# EAGLE board TeensyAmp_R5.0 (EAGLE 9.6.2)
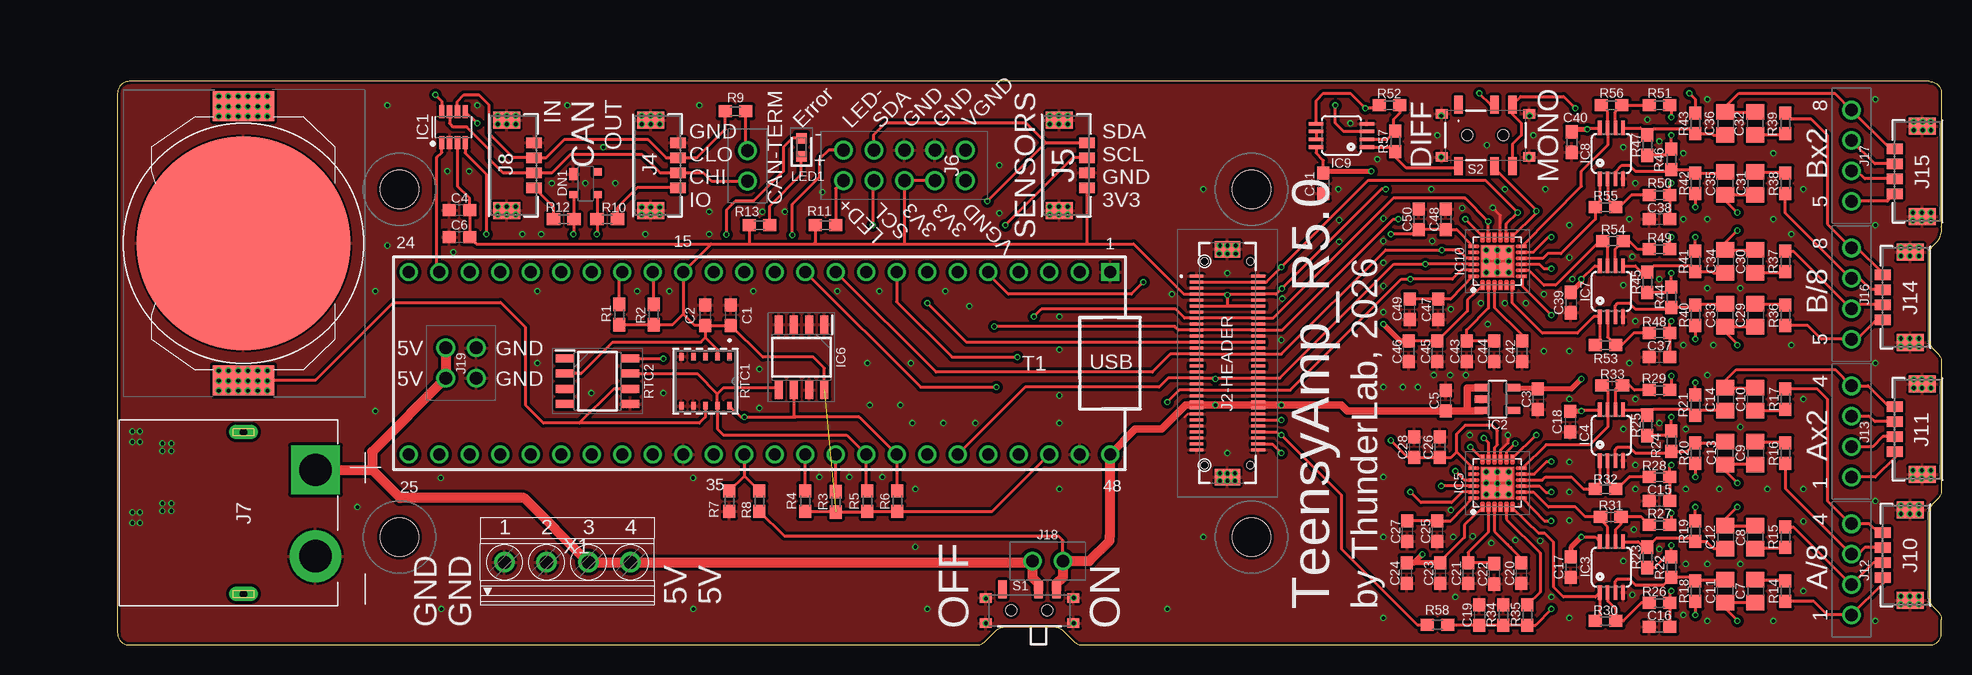
[diagram p3: board, top side]
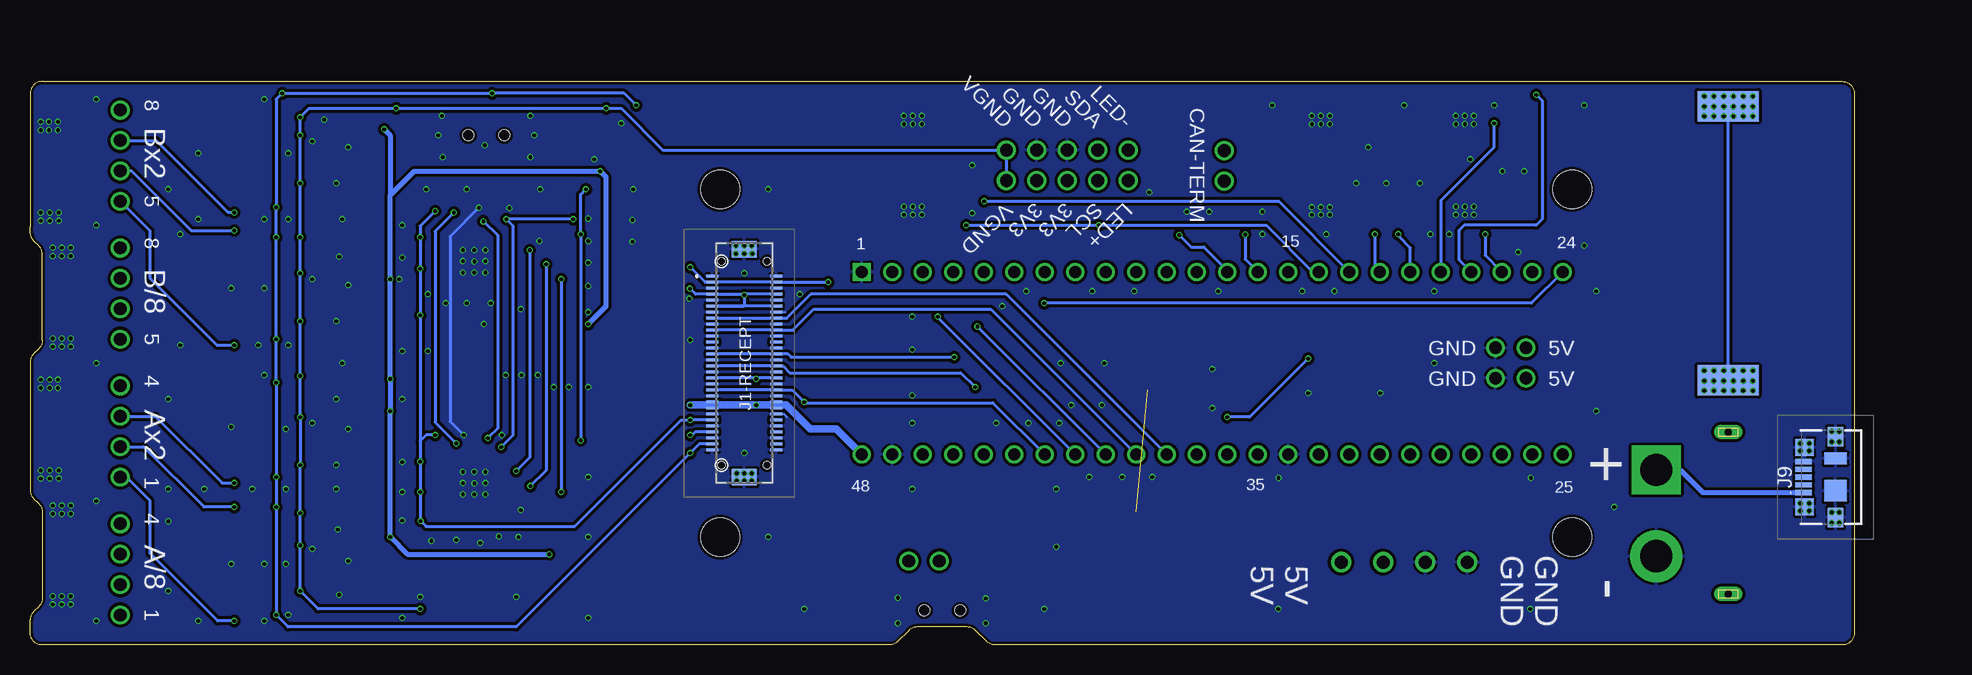
[diagram p4: board, bottom side, seen from below]

Size 152.02 x 47 mm. Coordinates in mm from the lower left corner, seen from the top.
Outline: 69.5,0 1,0 arc-90 0,1 0,46 arc-90 1,47 151,47 arc-90 152,46 152,34.91 arc-45 151.71,33.71 151.29,33.29 arc45 151,32.59 151,25.41 arc45 151.29,24.71 151.71,24.29 arc-45 152,23.59 152,12.91 arc-45 151.71,12.21 151.29,11.79 arc45 151,11.09 151,3.91 arc45 151.29,3.21 151.71,2.79 arc-45 152,2.09 152,1 arc-90 151,0 82.5,0 80.41,0 arc-45 79.71,0.29 78.79,1.21 arc45 78.09,1.5 73.91,1.5 arc45 73.21,1.21 72.29,0.29 arc-45 71.59,0 69.5,0
Outline: 69.5,0 69.59,0
Copper layers (1*16): Top 0.018mm / dielectric 1.55mm / Bottom 0.018mm
Design rules "Multi-CB_2L_100цm-Tracks_OL35цm *": minimum track width 0.1mm, minimum drill 0.2mm, track to track 0.1mm, track to pad 0.1mm, pad to pad 0.1mm, via to via 0.1mm, smd to smd 0mil, copper to edge 0.2mm, drill to drill 0.2mm, minimum pad ring 0.125mm, minimum via ring 0.1mm, stop-mask expansion 2mil, vias tented up to drill 0.45mm, thermal gap 0.2mm
Net classes: 0 default: clearance 0.205 mm
Holes 3.2 mm at 23.5,9 94.5,9 23.5,38 94.5,38

## Footprints (pad centres in the part's own frame; a part is rotated, then mirrored left to right if it is on the bottom)
BATHLD001 = smd 2.5 x 5.1: 1 -11.45,0; 2 11.43,0 | smd 2.54 x 5.08 bottom: 1B -11.43,0; 2B 11.43,0 | smd 17.8 x 17.8: 3 0,0
C0603 = smd 1.1 x 1: 1 -0.85,0; 2 0.85,0
C0805 = smd 1.3 x 1.5: 1 -0.95,0; 2 0.95,0
JMP1X2 = drill 1.05 pad 1.575: 1 0,0; 2 2.54,0
SOT143-R = smd 1 x 0.7: 1 -0.75,-1 | smd 0.6 x 0.7: 2 0.95,-1; 3 0.95,1; 4 -0.95,1
SOT65P280X145-8N = smd 1.1 x 0.44: 1 -1.3,0.975; 2 -1.3,0.325; 3 -1.3,-0.325; 4 -1.3,-0.975; 5 1.3,-0.975; 6 1.3,-0.325; 7 1.3,0.325; 8 1.3,0.975
SOT23-5 = smd 0.6 x 1.2: 1 -0.95,-1.306; 2 0,-1.306; 3 0.95,-1.306; 4 0.95,1.306; 5 -0.95,1.306
MSOP08 = smd 0.3 x 1.2: 1 -0.976,-2.113; 2 -0.326,-2.113; 3 0.324,-2.113; 4 0.974,-2.113; 5 0.974,2.112; 6 0.324,2.112; 7 -0.326,2.112; 8 -0.976,2.112
QFN50P400X400X80-25N = smd 0.5 x 0.2: 1 -2.05,1.25; 2 -2.05,0.75; 3 -2.05,0.25; 4 -2.05,-0.25; 5 -2.05,-0.75; 6 -2.05,-1.25; 13 2.05,-1.25; 14 2.05,-0.75; 15 2.05,-0.25; 16 2.05,0.25; 17 2.05,0.75; 18 2.05,1.25 | smd 0.2 x 0.5: 7 -1.25,-2.05; 8 -0.75,-2.05; 9 -0.25,-2.05; 10 0.25,-2.05; 11 0.75,-2.05; 12 1.25,-2.05; 19 1.25,2.05; 20 0.75,2.05; 21 0.25,2.05; 22 -0.25,2.05; 23 -0.75,2.05; 24 -1.25,2.05 | smd 1.1 x 1.1: 25 -0.71,0.7; 26 0.7,0.7; 27 -0.7,-0.7; 28 0.7,-0.7
SOIC127P600X175-8N = smd 1.525 x 0.65: 1 -2.712,1.905; 2 -2.712,0.635; 3 -2.712,-0.635; 4 -2.712,-1.905; 5 2.712,-1.905; 6 2.712,-0.635; 7 2.712,0.635; 8 2.712,1.905
DF173060DS05V57 = smd 0.25 x 1: 1 -7.25,-2.65; 2 -7.25,2.65; 3 -6.75,-2.65; 4 -6.75,2.65; 5 -6.25,-2.65; 6 -6.25,2.65; 7 -5.75,-2.65; 8 -5.75,2.65; 9 -5.25,-2.65; 10 -5.25,2.65; 11 -4.75,-2.65; 12 -4.75,2.65; 13 -4.25,-2.65; 14 -4.25,2.65; 15 -3.75,-2.65; 16 -3.75,2.65; 17 -3.25,-2.65; 18 -3.25,2.65; 19 -2.75,-2.65; 20 -2.75,2.65; 21 -2.25,-2.65; 22 -2.25,2.65; 23 -1.75,-2.65; 24 -1.75,2.65; 25 -1.25,-2.65; 26 -1.25,2.65; 27 -0.75,-2.65; 28 -0.75,2.65; 29 -0.25,-2.65; 30 -0.25,2.65; 31 0.25,-2.65; 32 0.25,2.65; 33 0.75,-2.65; 34 0.75,2.65; 35 1.25,-2.65; 36 1.25,2.65; 37 1.75,-2.65; 38 1.75,2.65; 39 2.25,-2.65; 40 2.25,2.65; 41 2.75,-2.65; 42 2.75,2.65; 43 3.25,-2.65; 44 3.25,2.65; 45 3.75,-2.65; 46 3.75,2.65; 47 4.25,-2.65; 48 4.25,2.65; 49 4.75,-2.65; 50 4.75,2.65; 51 5.25,-2.65; 52 5.25,2.65; 53 5.75,-2.65; 54 5.75,2.65; 55 6.25,-2.65; 56 6.25,2.65; 57 6.75,-2.65; 58 6.75,2.65; 59 7.25,-2.65; 60 7.25,2.65 | smd 1.4 x 2.1: MP1 -9.5,0; MP2 9.5,0 | hole 0.6: -8.5,-1.9; 8.5,-1.9
DF174060DP05V57 = smd 0.25 x 1.15: 1 -7.25,-2.575; 2 -7.25,2.575; 3 -6.75,-2.575; 4 -6.75,2.575; 5 -6.25,-2.575; 6 -6.25,2.575; 7 -5.75,-2.575; 8 -5.75,2.575; 9 -5.25,-2.575; 10 -5.25,2.575; 11 -4.75,-2.575; 12 -4.75,2.575; 13 -4.25,-2.575; 14 -4.25,2.575; 15 -3.75,-2.575; 16 -3.75,2.575; 17 -3.25,-2.575; 18 -3.25,2.575; 19 -2.75,-2.575; 20 -2.75,2.575; 21 -2.25,-2.575; 22 -2.25,2.575; 23 -1.75,-2.575; 24 -1.75,2.575; 25 -1.25,-2.575; 26 -1.25,2.575; 27 -0.75,-2.575; 28 -0.75,2.575; 29 -0.25,-2.575; 30 -0.25,2.575; 31 0.25,-2.575; 32 0.25,2.575; 33 0.75,-2.575; 34 0.75,2.575; 35 1.25,-2.575; 36 1.25,2.575; 37 1.75,-2.575; 38 1.75,2.575; 39 2.25,-2.575; 40 2.25,2.575; 41 2.75,-2.575; 42 2.75,2.575; 43 3.25,-2.575; 44 3.25,2.575; 45 3.75,-2.575; 46 3.75,2.575; 47 4.25,-2.575; 48 4.25,2.575; 49 4.75,-2.575; 50 4.75,2.575; 51 5.25,-2.575; 52 5.25,2.575; 53 5.75,-2.575; 54 5.75,2.575; 55 6.25,-2.575; 56 6.25,2.575; 57 6.75,-2.575; 58 6.75,2.575; 59 7.25,-2.575; 60 7.25,2.575 | smd 1.4 x 2.1: MP1 -9.5,0; MP2 9.5,0 | hole 0.6: -8.5,-1.9; 8.5,-1.9
CONN_50556804XX_MOL = smd 0.838 x 1.295: 1 -1.875,-1.72; 2 -0.625,-1.72; 3 0.625,-1.72; 4 1.875,-1.72 | smd 1.397 x 2.261: 5 -3.775,0.575; 6 3.775,0.575
JUMPER2X5FP = drill 1.05 pad 1.575: 1 0,-1.27; 2 0,1.27; 3 2.54,-1.27; 4 2.54,1.27; 5 5.08,-1.27; 6 5.08,1.27; 7 7.62,-1.27; 8 7.62,1.27; 9 10.16,-1.27; 10 10.16,1.27
AMASS_XT60PW-M = drill 2.7 pad 4.064 square: 1 3.6,-6 | drill 2.7 pad 4.318: 2 -3.6,-6 | drill 0.6 pad 1.2 long: S1 6.75,0; S2 -6.75,0
473460001 = smd 0.44 x 1.38: 1 -1.3,2.655; 2 -0.65,2.655; 3 0,2.655; 4 0.65,2.655; 5 1.3,2.655 | smd 1.425 x 1.55: 6 -2.487,2.57; 7 2.487,2.57 | smd 1.65 x 1.3: 8 -3.375,-0.005; 11 3.375,-0.005 | smd 1.8 x 1.9: 9 -1.14,0.005 | smd 1 x 1.9: 10 1.55,-0.005
CONN04_5055670471_MOL = smd 0.838 x 1.295: 1 1.875,-1.894; 2 0.625,-1.894; 3 -0.625,-1.894; 4 -1.875,-1.894 | smd 1.397 x 2.261: 5 -3.775,0.401; 6 3.775,0.401
JMP1X4 = drill 1.05 pad 1.575: 1 0,0; 2 2.54,0; 3 5.08,0; 4 7.62,0
JMP2X2 = drill 1.05 pad 1.575: 1 0,-1.27; 2 0,1.27; 3 2.54,-1.27; 4 2.54,1.27
LEDC1607X80N = smd 0.889 x 0.889: 1 -0.75,0; 2 0.75,0
R0603 = smd 1.1 x 1: 1 -0.85,0; 2 0.85,0
21-0140AK_L1055M-1_MXM-L = smd 0.61 x 0.406: 1 -2.045,2; 2 -2.045,1; 3 -2.045,0; 4 -2.045,-1; 5 -2.045,-2; 6 2.045,-2; 7 2.045,-1; 8 2.045,0; 9 2.045,1; 10 2.045,2
CUS12TB = smd 0.7 x 1.5: 1 -0.75,1.75; 2 2.25,1.75; 3 3.75,1.75 | smd 1 x 0.8: MP1 -2.15,1.05; MP2 5.15,1.05; MP3 -2.15,-1.05; MP4 5.15,-1.05 | hole 0.9: 0,0; 3,0
CUS22TB = smd 0.7 x 1.5: 1 -2.25,2.55; 2 0.75,2.55; 3 2.25,2.55; 4 -2.25,-2.55; 5 0.75,-2.55; 6 2.25,-2.55 | smd 1 x 0.8: MP1 -3.65,1.8; MP2 3.65,1.8; MP3 -3.65,-1.8; MP4 3.65,-1.8 | hole 0.9: -1.5,0; 1.5,0
TEENSY4.1_DIL = drill 1 square: 1 -29.21,-7.62 | drill 1: 2 -26.67,-7.62; 3 -24.13,-7.62; 4 -21.59,-7.62; 5 -19.05,-7.62; 6 -16.51,-7.62; 7 -13.97,-7.62; 8 -11.43,-7.62; 9 -8.89,-7.62; 10 -6.35,-7.62; 11 -3.81,-7.62; 12 -1.27,-7.62; 13 1.27,-7.62; 14 3.81,-7.62; 15 6.35,-7.62; 16 8.89,-7.62; 17 11.43,-7.62; 18 13.97,-7.62; 19 16.51,-7.62; 20 19.05,-7.62; 21 21.59,-7.62; 22 24.13,-7.62; 23 26.67,-7.62; 24 29.21,-7.62; 25 29.21,7.62; 26 26.67,7.62; 27 24.13,7.62; 28 21.59,7.62; 29 19.05,7.62; 30 16.51,7.62; 31 13.97,7.62; 32 11.43,7.62; 33 8.89,7.62; 34 6.35,7.62; 35 3.81,7.62; 36 1.27,7.62; 37 -1.27,7.62; 38 -3.81,7.62; 39 -6.35,7.62; 40 -8.89,7.62; 41 -11.43,7.62; 42 -13.97,7.62; 43 -16.51,7.62; 44 -19.05,7.62; 45 -21.59,7.62; 46 -24.13,7.62; 47 -26.67,7.62; 48 -29.21,7.62
1751264 = drill 1.1 pad 1.7: 1 -5.25,-0.1; 2 -1.75,-0.1; 3 1.75,-0.1; 4 5.25,-0.1

## Placement (x,y rotation side)
BT1  BAT-HLD-001  [BATHLD001]  10.5,33.5 270 top
C1  100n  [C0603]  51.12,27.5 90 top
C2  10µ  [C0603]  49,27.5 90 top
C3  10µ  [C0603]  118.38,20.5 270 top
C4  100n  [C0603]  28.5,36.25 180 top
C5  10µ  [C0603]  110.69,20.38 90 top
C6  10µ  [C0603]  28.5,34 180 top
C7  680nF  [C0805]  136.5,4.5 270 top
C8  680nF  [C0805]  136.5,9 90 top
C9  680nF  [C0805]  136.5,16 270 top
C10  680nF  [C0805]  136.5,20.5 90 top
C11  10µ  [C0805]  134,4.5 90 top
C12  10µ  [C0805]  134,9 270 top
C13  10µ  [C0805]  134,16 90 top
C14  10µ  [C0805]  134,20.5 270 top
C15  10µ  [C0603]  128.5,12 180 top
C16  10µ  [C0603]  128.5,1.5 180 top
C17  1µ  [C0603]  121.12,6.5 270 top
C18  1µ  [C0603]  121.06,18.62 270 top
C19  10µ  [C0603]  113.5,2.5 270 top
C20  10µ  [C0603]  117,6 90 top
C21  100n  [C0603]  112.56,6 90 top
C22  10µ  [C0603]  114.75,5.94 90 top
C23  100n  [C0603]  110.25,6 90 top
C24  10µ  [C0603]  107.44,6 90 top
C25  100n  [C0603]  110,9.5 90 top
C26  100n  [C0603]  110.19,16.5 270 top
C27  10µ  [C0603]  107.5,9.5 90 top
C28  10µ  [C0603]  108.06,16.5 270 top
C29  680nF  [C0805]  136.5,27.5 270 top
C30  680nF  [C0805]  136.5,32 90 top
C31  680nF  [C0805]  136.5,38.5 270 top
C32  680nF  [C0805]  136.5,43.5 90 top
C33  10µ  [C0805]  134,27.5 90 top
C34  10µ  [C0805]  134,32 270 top
C35  10µ  [C0805]  134,38.5 90 top
C36  10µ  [C0805]  134,43.5 270 top
C37  10µ  [C0603]  128.5,24 180 top
C38  10µ  [C0603]  128.5,35.5 180 top
C39  1µ  [C0603]  121.12,28.56 270 top
C40  1µ  [C0603]  121.19,41.94 270 top
C41  1µ  [C0603]  100.5,38.5 270 top
C42  10µ  [C0603]  117.06,24.5 90 top
C43  100n  [C0603]  112.44,24.5 90 top
C44  10µ  [C0603]  114.75,24.5 90 top
C45  100n  [C0603]  110,24.5 90 top
C46  10µ  [C0603]  107.62,24.5 90 top
C47  100n  [C0603]  110.06,28 90 top
C48  100n  [C0603]  110.69,35.5 270 top
C49  10µ  [C0603]  107.69,28 90 top
C50  10µ  [C0603]  108.44,35.5 270 top
CAN-TERM  JUMPER1X2  [JMP1X2]  52.5,38.69 90 top
DN1  SP0503  [SOT143-R]  39,38.5 270 top
IC1  TCAN330GDCN  [SOT65P280X145-8N]  28,43.19 90 top
IC2  NCP164CSN330T1G  [SOT23-5]  115,20.5 270 top
IC3  OPA1662  [MSOP08]  124.5,6.5 0 top
IC4  OPA1662  [MSOP08]  124.5,17.5 0 top
IC5  TLV320ADC5140IRTWR  [QFN50P400X400X80-25N]  115,13.5 90 top
IC6  EEPROM-24CS128T-I_SN  [SOIC127P600X175-8N]  57,24 270 top
IC7  OPA1662  [MSOP08]  124.5,29.5 0 top
IC8  OPA1662  [MSOP08]  124.5,41 0 top
IC9  OPA1662  [MSOP08]  102,42.5 90 top
IC10  TLV320ADC5140IRTWR  [QFN50P400X400X80-25N]  115,32 90 top
J1-RECEPT  DF17-60PINS-7MM-RECEPTABLE  [DF173060DS05V57]  92.5,23.5 270 bottom
J2-HEADER  DF17-60PINS-7MM-HEADER  [DF174060DP05V57]  92.5,23.5 270 top
J4  MICROLOCK-HEADER-4PIN-VERTICAL  [CONN_50556804XX_MOL]  45,40 90 top
J5  MICROLOCK-HEADER-4PIN-VERTICAL  [CONN_50556804XX_MOL]  79.06,40 90 top
J6  JUMPER2x5  [JUMPER2X5FP]  60.5,40 0 top
J7  XT60PW-M  [AMASS_XT60PW-M]  10.5,11 90 top
J8  MICROLOCK-HEADER-4PIN-VERTICAL  [CONN_50556804XX_MOL]  33,40 90 top
J9  USB-MICRO-B-RECEPTABLE  [473460001]  1.56,14 90 bottom
J10  MICROLOCK-HEADER-4PIN-HORIZONTAL  [CONN04_5055670471_MOL]  149,7.5 270 top
J11  MICROLOCK-HEADER-4PIN-HORIZONTAL  [CONN04_5055670471_MOL]  150,18 270 top
J12  JUMPER1X4  [JMP1X4]  144.5,2.5 90 top
J13  JUMPER1X4  [JMP1X4]  144.5,14 90 top
J14  MICROLOCK-HEADER-4PIN-HORIZONTAL  [CONN04_5055670471_MOL]  149,29 270 top
J15  MICROLOCK-HEADER-4PIN-HORIZONTAL  [CONN04_5055670471_MOL]  150,39.5 270 top
J16  JUMPER1X4  [JMP1X4]  144.5,25.5 90 top
J17  JUMPER1X4  [JMP1X4]  144.5,37 90 top
J18  JUMPER1X2  [JMP1X2]  76.25,7 0 top
J19  JUMPER2X2  [JMP2X2]  28.62,22.25 90 top
LED1  LTST-C190KRKT  [LEDC1607X80N]  57,41.5 90 top
R1  4,7k  [R0603]  41.81,27.56 270 top
R2  4,7k  [R0603]  44.69,27.56 270 top
R3  4,7k  [R0603]  59.88,11.94 270 top
R4  4,7k  [R0603]  57.31,12 270 top
R5  4,7k  [R0603]  62.5,12 270 top
R6  4,7k  [R0603]  65,12 270 top
R7  200k  [R0603]  51,12 90 top
R8  200k  [R0603]  53.5,12 270 top
R9  120  [R0603]  51.5,44.5 180 top
R10  1k  [R0603]  40.81,35.5 0 top
R11  330  [R0603]  59,35 180 top
R12  1k  [R0603]  37.19,35.5 180 top
R13  68  [R0603]  53.5,35 180 top
R14  1.5M  [R0603]  139,4.5 90 top
R15  1.5M  [R0603]  139,9 270 top
R16  1.5M  [R0603]  139,16 90 top
R17  1.5M  [R0603]  139,20.5 270 top
R18  200k  [R0603]  131.5,4.5 270 top
R19  200k  [R0603]  131.5,9.5 90 top
R20  200k  [R0603]  131.5,16 270 top
R21  200k  [R0603]  131.5,20 90 top
R22  200k  [R0603]  129.5,6.5 90 top
R23  200k  [R0603]  127.5,7.31 270 top
R24  200k  [R0603]  129.5,17 90 top
R25  200k  [R0603]  127.5,18.31 270 top
R26  47k  [R0603]  128.5,3.5 180 top
R27  47k  [R0603]  128.5,10 180 top
R28  47k  [R0603]  128.5,14 180 top
R29  47k  [R0603]  128.5,21.25 180 top
R30  47k  [R0603]  124,2 180 top
R31  47k  [R0603]  124.44,10.69 180 top
R32  47k  [R0603]  124,13 180 top
R33  47k  [R0603]  124.56,21.62 180 top
R34  3k  [R0603]  115.5,2.5 270 top
R35  3k  [R0603]  117.5,2.5 90 top
R36  1.5M  [R0603]  139,27.5 90 top
R37  1.5M  [R0603]  139,32 270 top
R38  1.5M  [R0603]  139,38.5 90 top
R39  1.5M  [R0603]  139,43.5 270 top
R40  200k  [R0603]  131.5,27.5 270 top
R41  200k  [R0603]  131.5,32 90 top
R42  200k  [R0603]  131.5,38.5 270 top
R43  200k  [R0603]  131.5,43.5 90 top
R44  200k  [R0603]  129.5,29 90 top
R45  200k  [R0603]  127.5,30.25 270 top
R46  200k  [R0603]  129.5,40.5 90 top
R47  200k  [R0603]  127.5,41.69 270 top
R48  47k  [R0603]  128.5,26 180 top
R49  47k  [R0603]  128.5,33 180 top
R50  47k  [R0603]  128.5,37.5 180 top
R51  47k  [R0603]  128.5,45 180 top
R52  47k  [R0603]  106,45 0 top
R53  47k  [R0603]  124,25 180 top
R54  47k  [R0603]  124.62,33.69 180 top
R55  47k  [R0603]  124,36.5 180 top
R56  47k  [R0603]  124.5,45 180 top
R57  47k  [R0603]  106.5,42 270 top
R58  0  [R0603]  110,1.69 0 top
RTC1  MAX31328NELB+T21-0140AK_L1055M-1_MXM-L  [21-0140AK_L1055M-1_MXM-L]  49,22 270 top
RTC2  DS3231MZ+  [SOIC127P600X175-8N]  40,22 0 top
S1  CUS-12TB  [CUS12TB]  74.5,2.88 0 top
S2  CUS-22TB  [CUS22TB]  114,42.5 0 top
T1  TEENSY4.1_DIL  [TEENSY4.1_DIL]  53.5,23.5 180 top
X1  TERMINAL-BLOCK-4  [1751264]  37.5,7 0 top

## Tracks (layer width: path | path; a pad name or v marks a point on that pad's centre or on a via)
+5V  (via drill 0.3)
  Top 0.254: R8.2 55.59,9.06 78.44,9.06 78.79,8.71 J18.2 | J2-HEADER.43 89.92,20 J2-HEADER.45 | J2-HEADER.44 95.08,20 J2-HEADER.46 | 82.69,9.06 82.71,9.09
  Top 0.61: IC2.1 112.5,21.45 112.5,19.52 | 112.5,19.52 C5.1 110.66,19.5 102.5,19.5 102,20 98,20 v97,20 95.08,20 v91.5,20 89.92,20 89.02,20 87.02,18 84.83,18 T1.48 | 112.5,19.52 113.67,19.52 IC2.3
  Top 0.813: 82.71,9.09 T1.48 | 82.69,9.06 82.69,8.69 81,7 J18.2 78.79,5.67 78.25,5.12 S1.3
  Bottom 0.254: J1-RECEPT.46 89.85,20 J1-RECEPT.44 | J1-RECEPT.43 95.15,20 J1-RECEPT.45
  Bottom 0.61: v97,20 95.15,20 v91.5,20 89.85,20 89.02,20 87.02,18 84.83,18 T1.48
A-ACH1
  Top 0.254: R14.1 141.35,3.65 142.5,2.5 J12.1 147.11,5.11 J10.1
A-ACH2
  Top 0.254: J10.2 146.34,6.88 J12.2 144.46,5.04 139.65,9.85 R15.1
A-ACH3
  Top 0.254: R16.1 139,13.08 J12.3 145.06,7.58 145.61,8.12 J10.3
A-ACH4
  Top 0.254: R17.1 141.65,21.35 142.5,20.5 142.5,12 144.38,10.12 J12.4 146,10.12 146.75,9.38 J10.4
A-CH1  (via drill 0.3)
  Top 0.254: v135,2 135,2.05 134,3.05 C11.1 C7.2 | J11.1 148.11,15.61 146.5,14 J13.1
  Bottom 0.254: v135,2 136.38,2 142,7.62 142,12 144,14 J13.1
A-CH2  (via drill 0.3)
  Top 0.254: C8.2 C12.1 134,10.5 v135,11.5 | J11.2 147.11,17.38 146.27,16.54 J13.2
  Bottom 0.254: v135,11.5 137.5,11.5 142.54,16.54 J13.2
A-CH3  (via drill 0.3)
  Top 0.254: J11.3 146.46,18.62 146,19.08 J13.3 | C9.2 C13.1 134,14.5 v135,13.5
  Bottom 0.254: J13.3 141.58,19.08 136,13.5 v135,13.5
A-CH4
  Top 0.254: J11.4 147.62,19.88 145.88,21.62 J13.4 143.15,22.97 134.91,22.97 134,22.06 C14.1 C10.2
A-INP1
  Top 0.254: R30.2 123.52,2.37 IC3.1 123.15,4.01 120.49,4.01 119.69,4.81 119.69,8.56 118.94,9.31 118.44,9.31 IC5.6
A-INP2
  Top 0.254: IC3.7 124.17,9.85 123.59,10.44 R31.2 122.31,10.69 121.5,11.5 119.25,11.5 118,12.75 IC5.8
A-INP3
  Top 0.254: IC4.1 123.52,13.37 R32.2 122.15,13 121.15,14 119,14 118.75,13.75 IC5.10
A-INP4
  Top 0.254: R33.2 123.91,21.62 124.17,21.36 IC4.7 124.17,18.17 122.69,16.69 119.06,16.69 117.12,14.75 IC5.12
AREF  (via drill 0.3)
  Top 0.254: IC5.11 118.08,14.25 119.12,15.29 v119.5,15.29 | v118.25,17.5 IC5.13 | IC5.9 118.5,13.25 119.03,12.72 119.46,12.72 v119.5,12.76 | IC10.13 118.25,36 v118.25,36.19 118.25,36.25 114.75,39.75 S2.5 | IC10.9 118.5,31.75 118.88,31.38 v119.5,31.38 | J2-HEADER.50 v97,18.75 | IC5.7 118.91,10.34 v119.47,10.34 | IC10.7 117.05,29.95 v119.5,27.5 | IC10.11 118,32.75 119.25,34 v119.5,34
  Bottom 0.254: 119.5,17 v119.5,15.29 v119.5,12.76 119.5,10.38 v119.47,10.34 119,9.88 106.62,9.88 97.75,18.75 v97,18.75 95.5,18.75 J1-RECEPT.49 | v118.25,36.19 119.5,34.94 v119.5,34 v119.5,31.38 v119.5,27.5 119.5,17 | 119.5,17 119,17.5 v118.25,17.5
AREG-A
  Top 0.254: IC5.2 114.25,9.41 112.56,7.72 C21.2 114.69,6.85 C22.2
AREG-B
  Top 0.254: IC10.2 114.25,28.1 112.44,26.29 C43.2 C44.2
AVRG  (via drill 0.3)
  Top 0.254: R21.2 v131.5,21.88 | R20.2 v131.5,14 | R19.2 v131.5,11.5 | R18.2 v131.5,2.5 | R40.2 v131.5,25.5 | R41.2 v131.5,34 | R42.2 v131.5,36.5 | v131,46 131.5,45.5 R43.2 | v113.5,46 113.5,45.99 114.44,45.05 S2.2 | IC9.3 102.18,42.82 101.5,43.5 v101.5,45 | J2-HEADER.58 96.25,16.75 v97,16
  Bottom 0.254: v101.5,45 102.5,46 v113.5,46 v131,46 131.5,45.5 v131.5,36.5 v131.5,34 v131.5,25.5 v131.5,21.88 v131.5,14 v131.5,11.5 v131.5,2.5 130.5,1.5 111.5,1.5 v97,16 96.25,16.75 J1-RECEPT.57
B-ACH1
  Top 0.254: J14.1 146.62,27.12 145,25.5 J16.1 142,25.5 140.85,26.65 R36.1
B-ACH2
  Top 0.254: J14.2 145.15,28.38 144.81,28.04 J16.2 144.46,28.04 139.65,32.85 R37.1
B-ACH3
  Top 0.254: J14.3 146.14,29.62 145.19,30.58 J16.3 144.42,30.58 139,36 R38.1
B-ACH4
  Top 0.254: J14.4 147.11,31.01 145,33.12 J16.4 142.5,35.12 142.5,42.5 141.15,43.85 139.5,43.85 R39.1
B-CH1  (via drill 0.3)
  Top 0.254: J15.1 148.11,37.61 147.5,37 J17.1 | C29.2 C33.1 134,26.11 135,25.11 v135,25
  Bottom 0.254: v135,25 136.44,25 142,30.56 142,34.5 J17.1
B-CH2  (via drill 0.3)
  Top 0.254: J15.2 145.61,38.88 144.94,39.54 J17.2 | C30.2 C34.1 134,33.56 v135,34.56
  Bottom 0.254: v135,34.56 138.56,34.56 143.54,39.54 J17.2
B-CH3  (via drill 0.3)
  Top 0.254: J17.3 146.46,40.12 J15.3 | C31.2 C35.1 134,37.05 134.99,36.06 v135,36.06
  Bottom 0.254: v135,36.06 135.5,36.06 141.52,42.08 J17.3
B-CH4
  Top 0.254: J15.4 147.75,41.38 J17.4 143.12,46 135.12,46 134,44.88 C36.1 C32.2
B-INP1
  Top 0.254: R53.2 123.52,25.37 IC7.1 123.02,27.39 121.65,26.01 118.74,26.01 116.25,28.5 IC10.6
B-INP2
  Top 0.254: IC7.7 124.17,33.29 R54.2 123.53,33.69 119.84,30 118.88,30 117.62,31.25 IC10.8
B-INP3
  Top 0.254: IC8.1 123.52,36.87 R55.2 123.15,35.5 120.28,32.62 119.19,32.62 118.81,32.25 IC10.10
B-INP4
  Top 0.254: R56.2 124.17,44.48 IC8.7 124.17,41.67 122,39.5 122,38.25 IC10.12
BCK  (via drill 0.3)
  Top 0.254: IC10.22 v109,31.75 106.38,31.75 96.88,22.25 J2-HEADER.36 91.58,22.25 91.51,22.19 v91.5,22.19 91.49,22.19 91.42,22.25 J2-HEADER.35 87.55,22.25 86.8,21.5 75.63,21.5 T1.43 | IC5.22 v110.31,13.25
  Bottom 0.254: v110.31,13.25 109,14.56 v109,31.75 | J1-RECEPT.35 91.65,22.25 91.59,22.19 v91.5,22.19 91.41,22.19 91.35,22.25 J1-RECEPT.36
CAN_IN
  Top 0.254: R12.2 36.34,36.51 J8.1
CAN_IO_IN  (via drill 0.3)
  Top 0.254: v38,34.25 38.04,34.29 R12.1 38.04,37.51 DN1.2
  Bottom 0.254: T1.19 36.99,33.12 38,34.13 v38,34.25
CAN_IO_OUT  (via drill 0.3)
  Top 0.254: v39.94,34.25 39.96,34.27 R10.1 40,35.54 DN1.3
  Bottom 0.254: T1.18 39.94,31.53 v39.94,34.25
CAN_OUT
  Top 0.254: J4.1 43.31,38.12 41.66,36.48 R10.2
CAN_RX  (via drill 0.3)
  Top 0.254: v30.75,34.25 30.75,39.25 28.98,41.02 IC1.4
  Bottom 0.254: T1.22 30.75,32.5 v30.75,34.25
CAN_S  (via drill 0.3)
  Top 0.254: v26.5,45.88 27.02,45.35 IC1.8
  Bottom 0.254: v26.5,45.88 26,45.38 26,35.5 26.5,35 32.5,35 32.91,34.59 32.91,32.12 T1.21
CAN_SHDN  (via drill 0.3)
  Top 0.254: IC1.5 29.96,43.5 v30,43.5
  Bottom 0.254: T1.20 34.45,37.05 30,41.5 v30,43.5
CAN_TX
  Top 0.254: IC1.1 27.02,41.08 26.62,40.67 26.62,31.32 T1.23
CANH
  Top 0.254: IC1.7 27.68,43.51 28,43.19 29.12,43.19 31,41.31 31,40.5 32.12,39.38 J8.2 36.22,39.38 37.72,40.88 43.72,40.88 45.22,39.38 J4.2 48.81,39.38 49.5,38.69 CAN-TERM.1
CANL
  Top 0.254: R9.2 50.65,43 48.27,40.62 J4.3 45.72,40.62 44.22,42.12 37.22,42.12 35.72,40.62 J8.3 33,40.62 30.96,42.66 30.96,45.04 30.12,45.88 28.88,45.88 28.32,45.33 IC1.6
DREG-A
  Top 0.254: C27.2 C25.2 111.09,10.35 IC5.24
DREG-B
  Top 0.254: C49.2 C47.2 111.1,28.85 IC10.24
GND  (via drill 0.3)
  Top 0.152: J2-HEADER.47 89.19,19.25 88.94,19
  Top 0.254: IC10.15 115.25,35.82 v114.61,36.47 | v115.88,17.5 115.88,16.84 115.25,16.21 IC5.15 | J1-RECEPT.MP1 v92.5,33.31 | J1-RECEPT.MP1 92.81,33.31 v93.19,33.31 | J1-RECEPT.MP1 v92.5,32.62 | J1-RECEPT.MP1 92.81,33 v93.19,32.62 | J1-RECEPT.MP1 92.19,33 v91.81,32.62 | IC10.26 114.54,32.94 v115,32.94 | IC5.26 114.54,14.44 v115,14.44
  Bottom 0.152: J1-RECEPT.48 89.19,19.25 88.94,19 | J1-RECEPT.14 89.08,27.75
  Bottom 0.254: v114.61,36.47 117,34.07 117,18.62 v115.88,17.5
  other vias: 35,23.5 62.69,20 26.94,13.94 65.25,20 47.96,13.94 48,3 68.83,18.5 71.5,18.5 66.25,18.5 49.31,36.12 73.5,36 40.5,41.5 77.69,44.12 79.19,44.12 78.44,44.12 77.69,43.44 78.44,43.44 79.19,43.44 148.62,33.12 150.12,33.12 149.38,33.12 148.62,32.44 149.38,32.44 150.12,32.44 148.62,25.56 150.12,25.56 149.38,25.56 148.62,24.88 149.38,24.88 150.12,24.88 148.62,11.62 150.12,11.62 149.38,11.62 148.62,10.94 149.38,10.94 150.12,10.94 148.62,4.06 150.12,4.06 149.38,4.06 148.62,3.38 149.38,3.38 150.12,3.38 77.69,36.56 79.19,36.56 78.44,36.56 77.69,35.88 78.44,35.88 79.19,35.88 149.62,14.56 150.38,14.56 151.12,14.56 149.62,13.88 150.38,13.88 151.12,13.88 149.69,22.12 150.38,22.12 151.12,22.12 151.12,21.44 150.38,21.44 149.69,21.44 149.69,43.62 150.44,43.62 151.12,43.62 149.69,42.94 150.44,42.94 151.12,42.94 150.38,36.06 151.12,36.06 149.62,36.06 149.62,35.38 150.38,35.38 151.12,35.38 125.5,7 121,10.38 121,12.75 121,15.25 121,20.5 121,24.5 125.5,30 121,35 119,38 138,41 138,35.5 135.25,29.75 139.5,25 135.25,18.19 137.5,13 135.25,6.75 138,2 140.5,4.5 140.5,13 139.5,34.25 140.5,38 126.5,38.5 126,35.5 132.5,35.5 132.5,29.75 126.5,27 126,23.5 125.5,18 126.5,15 126.5,13 133.5,13 132.5,6.75 126.25,4.19 121,2.25 132.5,2 110,42.5 118,42.5 111.12,28 105.5,21.5 111.5,4 105.5,2.25 140.5,20.5 130.5,41 130.5,35.5 130.5,25 130.69,18 130.69,13 130.69,6.75 118.56,8.69 105.5,9 105.5,14 102.75,43.5 60,29.5 63.5,29.5 63.75,14 21.5,19.5 21.5,29.5 114.12,41.69 79.69,3.94 79.69,1.81 72.38,3.88 72.38,1.81 91.88,33.31 91.88,14.31 92.5,14.31 93.12,14.31 93.12,13.69 92.5,13.69 91.88,13.69 118.88,24.5 114.06,14.44 115.94,14.44 115.94,12.56 114.06,12.56 116.5,8.75 109.5,38 115.94,32.94 115.94,31.06 126.38,9.62 127.5,43.81 125.5,41.5 31.69,44.12 32.44,44.12 33.19,44.12 31.69,43.44 32.44,43.44 33.19,43.44 31.69,36.56 32.44,36.56 33.19,36.56 31.69,35.88 32.44,35.88 33.19,35.88 43.69,44.12 44.44,44.12 45.19,44.12 43.69,43.44 44.44,43.44 45.19,43.44 43.69,36.5 44.44,36.5 45.19,36.5 43.69,35.88 44.44,35.88 45.19,35.88 1.25,17.81 1.25,16.94 1.25,11.06 1.25,10.19 3.75,11.19 3.75,16.19 39,38.5 114.06,31.06 107.12,21.5 108.38,21.5 20,11.5 90.5,38 90.5,9 73.5,40 58.75,37.75 53.75,36.12 55.62,36.12 44,34.25 33.75,34.25 37.5,45 22.5,45 48.5,45 27,3 67.5,3 66.5,13 78.5,13 53.5,19.75 53,29.5 69,29.5 78.5,27.38 112.69,17.5 114.5,8.5 114.19,26.75 105.5,35.56 105.5,33.69 109.56,33.69 105.5,31.88 105.5,29.94 105.5,27.75 105,40.5 101.75,38 117.38,28.5 92.5,31 92.5,16 101.81,33.62 101.81,35.44 113.62,28.5 118.88,29.25 115.62,28.5 112.94,9.06 121,32.31 115.62,38 132.5,45.5 128.5,42 128.5,30.5 133,25 126.5,20.5 128.5,18.5 128.5,8 130.5,2.5 140.5,10.31 146.5,12 146.5,23.5 146.5,35 146.5,45.5 146.5,2 132.5,22.5 28,32.75 66.5,8.19 46,29.5 43.31,29.5 35,29.5 53.5,23 71,28.25 78.5,20.81 97,25.44 58.5,14 61,14 36.19,38.5 41.5,38.5 121.25,30.5 126.25,32.38 49.31,34.25 4.5,16.81 4.5,16.19 3.75,16.81 1.88,17.81 1.88,16.94 1.88,11.06 1.88,10.19 3.75,11.81 4.5,11.81 4.5,11.19 114.06,13.5 115.94,13.5 115,12.56 114.99,13.48 114.06,32 114.99,31.98 115.94,32 115,31.06 109.69,22.5 111.06,22.5 112.38,22.5 112.06,36.44 111.31,9 111.12,11.25 119.5,4 114.06,32.94 110.31,44.12 110.31,40.69 117.62,40.69 117.69,44.12 45.5,21 39.5,21 87.5,3 22.5,33.31 78.5,24.62 62.5,23.5 78.5,18.5 66.12,23.5 97.06,28.88 87.88,29.25 30,45 32,40.5 29.31,39.5 27.5,39.5 35.31,34.25
  pour Top (isolate 0.254): 0,0 0,47 152,47 152,0
  pour Bottom (isolate 0.254): 0,0 0,47 152,47 152,0
IN1A  (via drill 0.3)
  Top 0.254: v111.5,14.5 112.25,13.75 IC5.21 | T1.10 68.22,22.75 86.25,22.75 87.75,24.25 J2-HEADER.27 J2-HEADER.28 97,24.25 105.69,32.94 v110.38,32.94 111.73,32.94 112.42,32.25 IC10.21
  Bottom 0.254: v110.38,32.94 110.38,15.62 v111.5,14.5
IN1B  (via drill 0.3)
  Top 0.254: T1.8 64.93,28.62 69.55,24 v75,24
  Bottom 0.254: J1-RECEPT.27 J1-RECEPT.28 88.85,24.25 88.6,24 v75,24
IN1C  (via drill 0.3)
  Top 0.254: T1.11 66.93,21.5 v73.25,21.5
  Bottom 0.254: v73.25,21.5 74.46,22.71 88.71,22.71 89.25,23.25 J1-RECEPT.32 J1-RECEPT.31
IN1D  (via drill 0.3)
  Top 0.254: J2-HEADER.24 90,25.25 J2-HEADER.23 70.75,25.25 v67.5,28.5
  Bottom 0.254: T1.24 26.91,28.5 v67.5,28.5
LED1  (via drill 0.3)
  Top 0.254: v56.25,34.19 56.25,36.75 58.5,39 58.5,40.5 59.27,41.27 J6.2
  Bottom 0.254: v56.25,34.19 55.25,33.19 54.19,33.19 52.23,31.23 T1.13
LED2  (via drill 0.3)
  Top 0.254: LED1.2 56.25,42.25 55.5,41.5 55.5,39.5 53,37 51.5,37 50.75,36.25 v50.75,34.23
  Bottom 0.254: v50.75,34.23 50.75,32.18 T1.14
LRCK  (via drill 0.3)
  Top 0.254: v87.5,20.25 87.5,20.26 88.49,21.25 J2-HEADER.39 J2-HEADER.40 97.75,21.25 107,30.5 v107.75,30.5 111.23,30.5 111.98,31.25 IC10.23 | v107.75,12.75 108.62,11.88 111.17,11.88 112.04,12.75 IC5.23
  Bottom 0.254: T1.42 71.78,20.19 87.44,20.19 v87.5,20.25 88.5,21.25 J1-RECEPT.40 J1-RECEPT.39 | v107.75,30.5 v107.75,12.75
MICBIAS
  Top 0.254: R35.2 118.56,4.41 118.56,7.67 115.75,10.48 IC5.5
N$1
  Top 0.254: J6.1 59.85,38.08 R11.1
N$2
  Top 0.254: CAN-TERM.2 52.35,41.38 R9.1
N$3
  Top 0.254: IC9.2 105.82,42.17 106.33,42.67 | 106.33,42.67 R57.1 | R52.2 106.85,44.35 106.33,43.83 106.33,42.67
N$4
  Top 0.254: R13.1 54.35,36.6 57,39.25 LED1.1
N$5
  Top 0.254: IC8.2 124.17,37.18 R55.1 125.15,36.5 126.15,37.5 R50.2
N$6
  Top 0.254: IC4.3 124.82,16.32 125,16.5 126,16.5 126.5,16 129.2,16 129.35,16.15 R24.1 130.8,16.15 R20.1 133.9,16.85 C13.2
N$8
  Top 0.254: IC4.5 126.97,19.61 127.42,19.16 R25.1 128,19.66 130.99,19.66 R21.1 131.9,19.55 C14.2
N$9
  Top 0.254: IC3.3 124.82,5.32 125,5.5 126,5.5 126.5,5 128.85,5 R22.1 131.2,5.65 R18.1 131.6,5.45 C11.2
N$10
  Top 0.254: IC3.5 126.72,8.61 127.17,8.16 R23.1 128.25,8.91 131.24,8.91 R19.1 132.4,8.65 133,8.05 C12.2
N$11
  Top 0.254: IC8.6 124.82,44.47 R56.1 R51.2
N$12
  Top 0.254: IC7.2 124.17,25.68 R53.1 125.35,25 126.35,26 R48.2
N$13
  Top 0.254: IC3.6 124.82,9.61 125.29,10.07 R31.1 126.96,10.69 R27.2
N$14
  Top 0.254: IC7.6 124.82,33.04 R54.1 125.96,33.69 126.65,33 R49.2
N$15
  Top 0.254: C7.1 138.9,5.45 R14.2
N$16
  Top 0.254: R15.2 138.9,8.05 C8.1
N$17
  Top 0.254: C35.2 133.9,39.35 R42.1 131.2,39.65 R46.1 129.35,39.5 126.5,39.5 126,40 125.37,40 124.82,39.46 IC8.3
N$18
  Top 0.254: C9.1 138.9,16.95 R16.2
N$19
  Top 0.254: C36.2 133.95,42.5 133,42.5 132.85,42.65 R43.1 131.46,42.61 130.99,43.08 128.04,43.08 R47.1 126.92,43.11 IC8.5
N$20
  Top 0.254: C33.2 131.6,28.45 R40.1 131.3,28.15 R44.1 129.35,28 126.5,28 126,28.5 125,28.5 124.82,28.32 IC7.3
N$21
  Top 0.254: C34.2 133.95,31 133,31 132.85,31.15 R41.1 131.05,31.6 128,31.6 R45.1 127,31.1 126.49,31.61 IC7.5
N$22
  Top 0.254: C29.1 138.9,28.45 R36.2
N$23
  Top 0.254: C30.1 138.9,31.05 R37.2
N$24
  Top 0.254: IC9.1 106.13,41.52 R57.2 106.5,40.68 107.4,39.78 111.58,39.78 S2.4
N$25
  Top 0.254: C31.1 138.9,39.45 R38.2
N$26
  Top 0.254: C32.1 138.9,42.55 R39.2
N$27
  Top 0.254: C10.1 138.9,19.55 R17.2
N$28
  Top 0.254: IC9.6 IC9.7
N$31
  Top 0.254: IC4.2 124.17,13.68 R32.1 125,13 126,14 R28.2
N$32
  Top 0.254: IC4.6 124.82,21.32 125.12,21.62 R33.1 126.03,21.62 126.4,21.25 R29.2
N$33
  Top 0.254: IC3.2 124.17,3.68 124.85,3 R30.1 125.5,2 127,3.5 R26.2
SCL  (via drill 0.3)
  Top 0.254: R6.1 64.93,12.92 T1.41 61.81,19 56.5,19 | 56.5,19 v52.25,19 51.95,19 RTC1.10 | IC5.17 114.25,16.88 v113.88,17.25 | IC10.17 114.25,35.31 v114.23,35.33 112.31,37.25 106.31,37.25 96.31,27.25 J2-HEADER.16 J2-HEADER.15 88.92,27.25 88.17,28 77,28 v76.38,27.38 | IC6.6 56.37,19.14 56.5,19 | RTC2.8 45.47,23.91 v45.5,23.88
  Bottom 0.254: T1.41 76.38,27.32 v76.38,27.38 | v113.88,17.25 113.04,18.08 113.04,34.17 114.21,35.33 v114.23,35.33 | v45.5,23.88 50.38,19 v52.25,19
SCL2
  Top 0.254: R4.1 T1.38
  Bottom 0.254: T1.38 70.68,29.25 86.94,29.25 88.94,27.25 J1-RECEPT.16 J1-RECEPT.15
SCLSNS  (via drill 0.3)
  Top 0.254: J5.3 79.62,40.62 v74,35 | R2.1 44.69,31.04 T1.16 | J6.3 62.94,38.63 v62.94,35
  Bottom 0.254: T1.16 45.11,31.12 48.99,35 v62.94,35 v74,35
SDA  (via drill 0.3)
  Top 0.254: v112.32,35.51 113.75,34.09 IC10.18 | v106.75,35.5 106.31,35.5 97.06,26.25 J2-HEADER.20 J2-HEADER.19 88.42,26.25 88.11,26.56 v73.06,26.56 | R5.1 62.39,12.96 T1.40 60.77,17.5 50.5,17.5 50,18 RTC1.9 50,20.95 | IC5.18 113.7,15.55 v112.75,16.5 | 50,20.95 50.5,21.45 54.93,21.45 IC6.5 | RTC2.7 48.32,22.64 50,20.95
  Bottom 0.254: v112.75,16.5 111.75,17.5 111.75,34.94 v112.32,35.51 v112.31,35.5 v106.75,35.5 | v73.06,26.56 v73.06,26.55 T1.40
SDA2
  Top 0.254: R3.1 59.88,15.86 T1.39
  Bottom 0.254: J1-RECEPT.19 J1-RECEPT.20 88.44,26.25 86.69,28 71.97,28 T1.39
SDASNS  (via drill 0.3)
  Top 0.254: 77.38,41.88 J5.4 | 77.38,41.88 v72.5,37 | R1.1 41.81,30.86 T1.17 | J6.4 63,41.31 63,42.5 64,43.5 75.75,43.5 77.38,41.88
  Bottom 0.254: T1.17 47.95,37 v72.5,37
SHDN  (via drill 0.3)
  Top 0.254: T1.5 72.55,30.95 74.25,29.25 84.5,29.25 v85.5,30.25 | IC10.14 115.75,35.12 v116.69,36.06 114,38.75 104.25,38.75 v97,31.5 95.75,30.25 J2-HEADER.4 J2-HEADER.3 | v116.5,16.81 115.75,16.06 IC5.14
  Bottom 0.254: v116.69,36.06 118.25,34.5 118.25,18.56 v116.5,16.81 | v97,31.5 95.75,30.25 J1-RECEPT.3 J1-RECEPT.4 v85.5,30.25
VBAT  (via drill 0.3)  (1 unrouted)
  Top 0.254: RTC1.8 49,19 48.5,18.5 38.5,18.5 | 38.5,18.5 35.5,18.5 34,20 34,26.5 31.93,28.57 23,28.57 16.5,22.07 BT1.2B 10.84,22.07 v10.88,22.03 | RTC2.6 41.37,21.36 38.5,18.5
  Bottom 0.254: v9.25,22.88 v8.44,22.88 v8.44,22.03 | v9.25,22.88 v10.06,22.88 | v10.06,22.88 v10.88,22.88 | v10.88,22.88 v11.69,22.88 | v11.69,22.88 v12.5,22.88 v12.5,22.03 | v9.25,21.22 v8.44,21.22 v8.44,22.03 | v9.25,21.22 v10.06,21.22 | v10.06,21.22 v10.88,21.22 | v10.88,21.22 v11.69,21.22 | v11.69,21.22 v12.5,21.22 v12.5,22.03 | v11.69,22.88 v11.69,22.03 | v11.69,22.03 v12.5,22.03 | v11.69,22.03 v11.69,21.22 | v10.88,21.22 v10.88,22.03 | v10.88,22.03 v10.88,22.88 | v10.06,22.88 v10.06,22.03 | v10.06,22.03 10.5,22.03 | 10.5,22.03 v10.88,22.03 | v10.88,22.03 v11.69,22.03 | v10.06,21.22 v10.06,22.03 | v10.06,22.03 v9.25,22.03 | v9.25,22.88 v9.25,22.03 | v9.25,22.03 v9.25,21.22 | v9.25,22.03 v8.44,22.03 | v9.25,45.75 v8.44,45.75 v8.44,44.91 | v9.25,45.75 v10.06,45.75 | v10.06,45.75 v10.88,45.75 | v10.88,45.75 v11.69,45.75 | v11.69,45.75 v12.5,45.75 v12.5,44.91 | v8.44,44.91 v9.25,44.91 | v9.25,44.91 v10.06,44.91 | v10.06,44.91 v10.88,44.91 | v10.88,44.91 v11.69,44.91 | v11.69,44.91 v12.5,44.91 | v9.25,44.09 v8.44,44.09 v8.44,44.91 | v9.25,44.09 v10.06,44.09 | v10.06,44.09 v10.88,44.09 | v10.88,44.09 v11.69,44.09 | v11.69,44.09 v12.5,44.09 v12.5,44.91 | v11.69,45.75 v11.69,44.91 | v11.69,44.91 v11.69,44.09 | v10.88,45.75 v10.88,44.91 | v10.88,44.91 v10.88,44.09 | v10.06,45.75 v10.06,44.91 | v10.06,44.91 v10.06,44.09 | v9.25,45.75 v9.25,44.91 | v9.25,44.91 v9.25,44.09 | 10.5,22.03 BT1.2B BT1.1B 10.52,44.91 v10.88,44.91
VDD  (via drill 0.3)  (1 unrouted)
  Top 0.254: C2.1 49,25.65 | 49,25.65 50,24.65 RTC1.2 | 47.15,27.6 T1.15 49.48,33.45 | C2.1 C1.1 | C1.1 51.14,26.64 | C2.1 48.1,26.65 47.15,27.6 | T1.46 72.9,11.15 R6.2 R5.2 62.44,11.09 R3.2 59.81,11.15 R4.2 | IC10.19 111.6,34.65 C48.2 C50.2 108.04,34.25 v106.12,34.25 | IC5.16 114.75,16.44 115,16.69 115,17.88 114.56,18.31 112.31,18.31 111.6,17.6 111.6,16.1 | J5.1 80.78,33.45 | 49.48,33.45 52.65,33.45 | 52.65,33.45 58,33.45 | 58,33.45 63,33.45 | 63,33.45 65.5,33.45 | 65.5,33.45 80.78,33.45 | R1.2 R2.2 46.26,26.71 47.15,27.6 | 49.48,33.45 29.91,33.45 C6.1 C4.1 29.35,37.25 28.32,38.27 IC1.3 | 63.04,33.48 63,33.45 | R13.2 52.65,33.45 | IC6.8 58.91,23.09 58,24 53.77,24 C1.1 | v106.12,17.06 107.54,15.65 C28.2 C26.2 111.15,15.65 111.6,16.1 | 80.78,33.45 84.68,33.45 88.88,29.25 J2-HEADER.7 92.42,29.25 92.49,29.19 v92.5,29.19 | v105.69,38 105.31,38 v97.03,29.72 96.56,29.25 J2-HEADER.8 92.58,29.25 92.51,29.19 v92.5,29.19 | R11.2 58.15,33.59 58,33.45 | IC5.19 111.6,16.1 | RTC2.2 38.63,22.64 41.26,25.26 48.61,25.26 49,25.65 | 68,38.61 J6.7 J6.5 65.58,33.52 65.5,33.45 | v92.5,29.19 92.5,28.25 J2-HEADER.12 J2-HEADER.11
  Bottom 0.254: v106.12,17.06 v106.12,34.25 106.12,37.56 v105.69,38 | v92.5,29.19 92.5,28.25 J1-RECEPT.11 J1-RECEPT.12 | v92.5,29.19 92.59,29.19 92.65,29.25 J1-RECEPT.7 96.56,29.25 v97.03,29.72 | J1-RECEPT.8 92.35,29.25 92.41,29.19 v92.5,29.19
VDDA  (via drill 0.3)
  Top 0.254: IC5.1 112.25,10 112.25,8.97 110.25,6.97 C23.2 | IC10.1 112.5,28.75 112.5,27.85 C45.2 C46.2 | 121.97,19.48 v122,19.5 122.11,19.61 IC4.8 | v122.5,43 122.61,43.11 IC8.8 | v122,30.5 123.11,31.61 IC7.8 | v122,9 123.14,9 IC3.8 | IC9.8 99.89,41.02 100.5,40.41 C41.1
  Top 0.406: C40.1 121.4,43 v122.5,43 | v122,22.19 121.16,21.35 C3.1 118.28,21.45 IC2.5 | C46.2 106.9,25.35 v105.5,26.75 | C23.2 C24.2 108.04,6.85 v108.75,7.56 | 121.97,19.48 C18.1 | C39.1 122,30.29 v122,30.5 | v122,9 121.12,8.12 C17.1 | C41.1 100.65,39.5 v104.5,39.5
  Bottom 0.406: v108.75,7.56 120.56,7.56 v122,9 v122,19.5 v122,22.19 v122,30.5 122,37.5 | v122.5,43 122,42.5 122,37.5 | v105.5,26.75 104,28.25 104,39 v104.5,39.5 120,39.5 122,37.5
VGND  (via drill 0.3)
  Top 0.254: R47.2 128.99,40.84 R46.2 v129.5,42.5 | R45.2 129.05,29.4 R44.2 v129.5,31 | C38.1 R50.1 129.35,38.35 v129.5,38.5 | C37.1 R48.1 129.35,26.85 v129.5,27 | R25.2 129.11,17.46 R24.2 v129.5,19 | R23.2 128.11,6.46 129,7.35 R22.2 v129.5,8.31 | R27.1 129.47,10.12 129.47,10.97 v129.5,11 | C16.1 R26.1 129.35,4.35 v129.5,4.5 | C15.1 R28.1 129.35,14.85 v129.5,15 | v121.5,44.75 120.51,45.74 116.94,45.74 S2.3 116.25,44.25 117,43.5 117,42.5 116.25,41.75 S2.6 | IC9.5 99.89,45.39 100.5,46 102.75,46 v104,44.75 104.9,44.75 R52.1 | v119.5,3 119.5,2.96 118.19,1.65 R35.1 R34.2 C19.2 113.46,1.69 R58.2 | R49.1 129.35,33.85 v129.5,34 | R51.1 129.5,44.85 v129.5,44 | v129.5,22.44 129.5,21.4 R29.1
  Bottom 0.254: v119.5,3 128,3 v129.5,4.5 v129.5,8.31 v129.5,11 v129.5,15 v129.5,19 v129.5,22.44 v129.5,27 v129.5,31 v129.5,34 v129.5,38.5 v129.5,42.5 v129.5,44 128.75,44.75 v121.5,44.75 v104,44.75 102.75,44.75 99.27,41.27 J6.10 J6.9
VGND1  (via drill 0.3)
  Top 0.254: J2-HEADER.54 96.58,17.75 96.83,17.5 v97,17.5 102,12.5 102,8 108.31,1.69 R58.1
  Bottom 0.254: J1-RECEPT.53 96.59,17.75 96.84,17.5 v97,17.5
VIN2
  Top 0.254: R7.2 52.23,14.08 T1.36 52.23,14.12 R8.1
VREF-A
  Top 0.254: C20.2 117,7.23 116.11,8.12 115.86,8.37 114.75,9.48 IC5.3
VREF-B
  Top 0.254: IC10.3 114.75,28.16 117.06,25.85 C42.2
VSS
  Top 0.813: J7.1 19.71,14.6 21.21,14.6 | 21.21,14.6 23.55,12.26 33.89,12.26 X1.3 X1.4 76.15,6.9 J18.1 76.25,5.62 76.75,5.12 S1.2 | J19.4 J19.2 21.21,16.11 21.21,14.6
  Bottom 0.406: J9.1 12.6,12.7 14.5,14.6 J7.1

## Text on the board
tNames: IN | OUT | CAN | 8 | Error | - | LED- | SDA | GND | GND | VGND | DIFF | MONO | Bx2 | GND / CLO / CHI / IO | + | SENSORS | SDA / SCL / GND / 3V3 | LED+ | SCL | 3V3 | 3V3 | VGND | 5 | 8 | B/8 | 5 | 5V / 5V | GND / GND | USB | 4 | Ax2 | 1 | 4 | A/8 | 5V / 5V | GND / GND | by ThunderLab, 2026 | 1 | OFF | ON
bNames: 8 | LED- | SDA | GND | GND | VGND | Bx2 | CAN-TERM | LED+ | SCL | 3V3 | 3V3 | VGND | 5 | 8 | B/8 | 5 | 5V / 5V | GND / GND | 4 | Ax2 | + | 1 | 4 | A/8 | - | 5V / 5V | GND / GND | 1